# EAGLE design schematic (EAGLE 8.3.0)
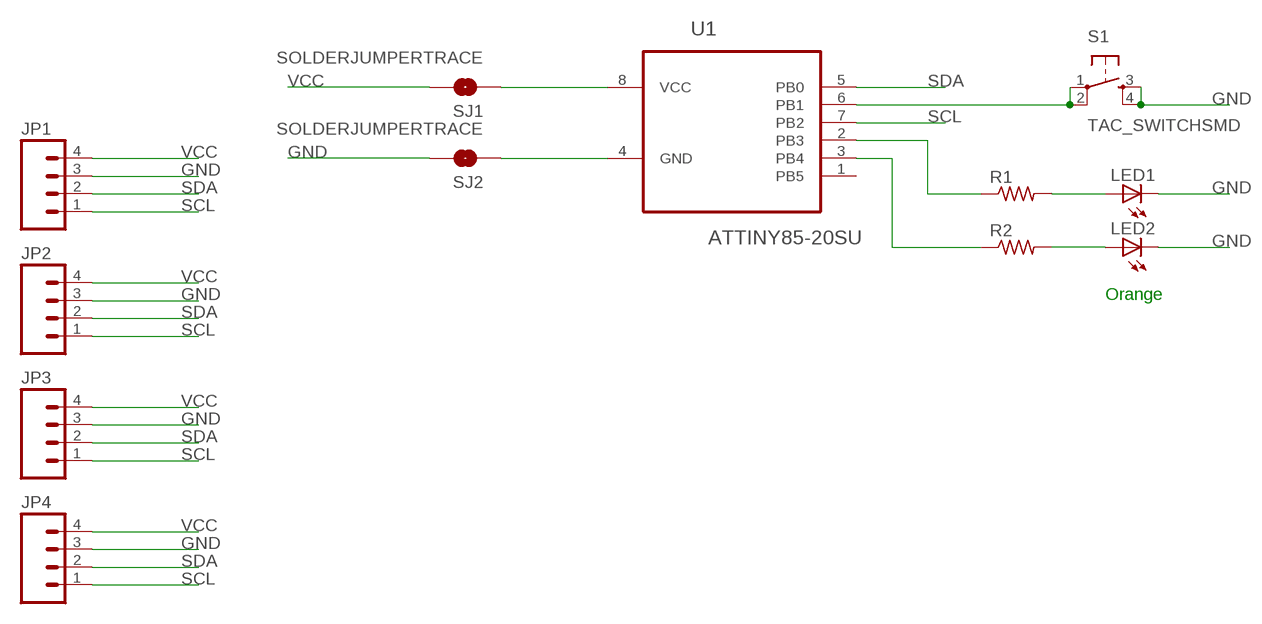
[diagram p0: schematic, sheet 1]

## Parts
JP1  M041X04_NO_SILK  [1X04_NO_SILK]
JP2  M041X04_NO_SILK  [1X04_NO_SILK]
JP3  M041X04_NO_SILK  [1X04_NO_SILK]
JP4  M041X04_NO_SILK  [1X04_NO_SILK]
LED1  LEDCHIP-LED0805  [CHIP-LED0805]
LED2  LEDCHIP-LED0805  [CHIP-LED0805]
R1  R-US_R0805  [R0805]
R2  R-US_R0805  [R0805]
S1  TAC_SWITCHSMD  [TACTILE-SWITCH-SMD]
SJ1  SOLDERJUMPERTRACE  [SJ_2S-TRACE]
SJ2  SOLDERJUMPERTRACE  [SJ_2S-TRACE]
U1  ATTINY85-20SU  [SOIC127P798X216-8N]

## Nets
GND: JP1.3 JP2.3 JP3.3 JP4.3 LED1.C LED2.C S1.3 S1.4 SJ2.2
N$1: R2.1 U1.3(PB4)
N$2: R1.1 U1.2(PB3)
N$3: LED1.A R1.2
N$4: LED2.A R2.2
N$5: S1.1 S1.2 U1.6(PB1)
N$8: SJ1.1 U1.8(VCC)
N$9: SJ2.1 U1.4(GND)
SCL: JP1.1 JP2.1 JP3.1 JP4.1 U1.7(PB2)
SDA: JP1.2 JP2.2 JP3.2 JP4.2 U1.5(PB0)
VCC: JP1.4 JP2.4 JP3.4 JP4.4 SJ1.2
Unconnected: U1.1(PB5)

## Notes on the sheet
- Orange

## Library data of the parts
JP1-JP4 = SparkFun-Connectors:M04: Header 4 Standard 4-pin 0.1" header. Use with straight break away headers (SKU : PRT-00116), right angle break away headers (PRT-00553), swiss pins (PRT-00743), machine pins (PRT-00117), and female headers (PRT-00115). Molex polarized connector foot print use with SKU : PRT-08231 with associated crimp pins and housings. 1MM SMD Version SKU: PRT-10208
LED1 LED2 = adafruit:LED: LED OSRAM: - CHIPLED LG R971, LG N971, LY N971, LG Q971, LY Q971, LO R971, LY R971 LH N974, LH R974 LS Q976, LO Q976, LY Q976 LO Q996 - Hyper CHIPLED LW Q18S LB Q993, LB Q99A, LB R99A - SideLED LS A670, LO A670, LY A670, LG A670, LP A670 LB A673, LV A673, LT A673, LW A673 LH A674 LY A675 LS A676, LA A676, LO A676, LY A676, LW A676 LS A679, LY A679, LG A679 - Hyper Micro SIDELED® LS Y876, LA Y876, LO Y876, LY Y876 LT Y87S - SmartLED LW L88C, LW L88S LB L89C, LB L89S, LG L890 LS L89K, LO L89K, LY L89K LS L896, LA L896, LO L896, LY L896 - TOPLED LS T670, LO T670, LY T670, LG T670, LP T670 LSG T670, LSP T670, LSY T670, LOP T670, LYG T670 LG T671, LOG T671, LSG T671 LB T673, LV T673, LT T673, LW T673 LH T674 LS T676, LA T676, LO T676, LY T676, LB T676, LH T676, LSB T676, LW T676 LB T67C, LV T67C, LT T67C, LS T67K, LO T67K, LY T67K, LW E67C LS E67B, LA E67B, LO E67B, LY E67B, LB E67C, LV E67C, LT E67C LW T67C LS T679, LY T679, LG T679 LS T770, LO T770, LY T770, LG T770, LP T770 LB T773, LV T773, LT T773, LW T773 LH T774 LS E675, LA E675, LY E675, LS T675 LS T776, LA T776, LO T776, LY T776, LB T776 LHGB T686 LT T68C, LB T68C - Hyper Mini TOPLED® LB M676 - Mini TOPLED Santana® LG M470 LS M47K, LO M47K, LY M47K Source: http://www.osram.convergy.de/
R1 R2 = adafruit:R-US_: RESISTOR, American symbol
S1 = SparkFun-Retired:TAC_SWITCH: Momentary Switch Button commonly used for reset or general input. Spark Fun Electronics SKU : COM-00097 SMT- SWCH-08247; PROD_ID: SWCH-08247
SJ1 SJ2 = SparkFun-Retired:SOLDERJUMPER: Solder Jumper Standard SMD solder jumper. Used to automate production. Two varients : Normally Open and Normally Closed are the same, but have different paste layers. NC will have a large amount of paste and should jumper during reflow.
U1 = Atmel_By_element14_Batch_1-00:ATTINY85-20SU: 8-bit Microcontroller with In-System Programmable Flash; MPN: ATTINY85-20SU; OC_FARNELL: 1455164; OC_NEWARK: 58M3797; PACKAGE: SOIC-8; SUPPLIER: Atmel

## Board
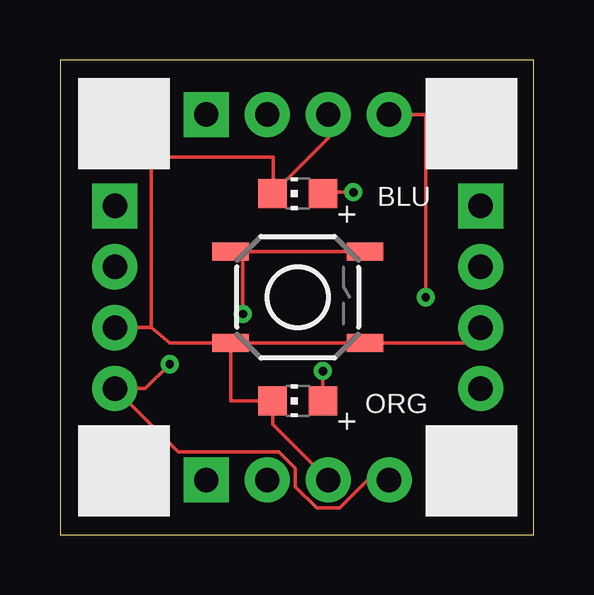
[diagram p1: board, top side]
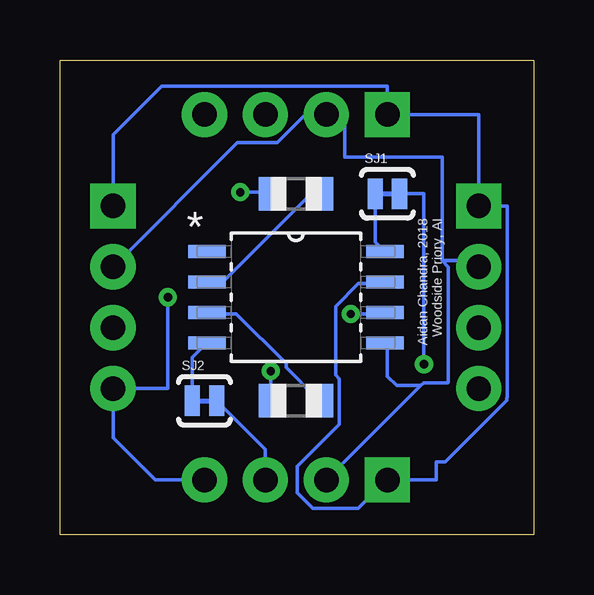
[diagram p2: board, bottom side, seen from below]

Size 19.74 x 19.8 mm. Coordinates in mm from the lower left corner, seen from the top.
Outline: 0,0 19.74,0 19.74,19.8 0,19.8 0,0
Copper layers (1*16): Top 0.035mm / dielectric 1.5mm / Bottom 0.035mm
Design rules "default": minimum track width 6mil, minimum drill 0.35mm, track to track 6mil, track to pad 6mil, pad to pad 6mil, via to via 6mil, smd to smd 6mil, copper to edge 40mil, drill to drill 6mil, minimum pad ring 10mil, minimum via ring 8mil, stop-mask expansion 4mil, vias tented up to drill 0mil, thermal gap 10mil

### Footprints (pad centres in the part's own frame; a part is rotated, then mirrored left to right if it is on the bottom)
1X04_NO_SILK = drill 1.016 pad 1.88 square: 1 0,0 | drill 1.016 pad 1.88: 2 2.54,0; 3 5.08,0; 4 7.62,0
CHIP-LED0805 = smd 1.2 x 1.2: A 0,-1.05; C 0,1.05
R0805 = smd 1.1 x 1.4: 1 -1,0; 2 1,0
TACTILE-SWITCH-SMD = smd 1.524 x 0.762: 1 -2.794,1.905; 2 2.794,1.905; 3 -2.794,-1.905; 4 2.794,-1.905
SJ_2S-TRACE = smd 0.635 x 1.27: 1 -0.508,0; 2 0.508,0
SOIC127P798X216-8N = smd 1.549 x 0.533: 1 -3.708,1.905; 2 -3.708,0.635; 3 -3.708,-0.635; 4 -3.708,-1.905; 5 3.708,-1.905; 6 3.708,-0.635; 7 3.708,0.635; 8 3.708,1.905

### Placement (x,y rotation side)
JP1  2.29,13.72 270 top
JP2  6.1,2.29 0 top
JP3  17.53,13.72 270 top
JP4  6.1,17.53 0 top
LED1  9.91,14.22 90 top
LED2  9.91,5.59 90 top
R1  9.91,14.22 180 bottom
R2  9.91,5.59 180 bottom
S1  9.91,9.91 0 top
SJ1  6.1,14.22 0 bottom
SJ2  13.72,5.59 0 bottom
U1  9.91,9.91 0 bottom

### Tracks (layer width: path | path; a pad name or v marks a point on that pad's centre or on a via)
GND
  Top 0.152: JP1.3 3.81,8.64 | JP4.3 11.18,16.54 LED1.C 8.89,14.26 8.89,15.75 3.81,15.75 3.81,8.64 | S1.3 S1.4 17.53,8 JP3.3 | S1.3 4.57,8 3.81,8.64 | JP2.3 8.86,4.61 LED2.C 7.11,5.59 S1.3
  Bottom 0.152: JP2.3 11.18,3.56 SJ2.2
N$1
  Bottom 0.152: R2.1 9.05,5.71 10.32,6.99 10.32,7.14 12.38,9.21 13.49,9.21 U1.3
N$2
  Bottom 0.152: R1.1 9.05,14.13 9.37,14.13 12.86,10.64 13.49,10.64 U1.2
N$3  (via drill 0.35)
  Top 0.152: v12.22,14.29 11.11,14.29 LED1.A
  Bottom 0.152: v12.22,14.29 10.95,14.29 R1.2
N$4  (via drill 0.35)
  Top 0.152: v10.95,6.83 10.95,5.71 LED2.A
  Bottom 0.152: v10.95,6.83 10.95,5.71 R2.2
N$5  (via drill 0.35)
  Top 0.152: S1.2 S1.1 7.62,11.75 v7.62,9.21
  Bottom 0.152: v7.62,9.21 6.35,9.21 U1.6
N$8
  Bottom 0.152: SJ1.1 6.6,12.22 U1.8
N$9
  Bottom 0.152: SJ2.1 14.22,7.39 U1.4
SCL
  Bottom 0.152: U1.7 6.35,10.48 7.3,10.48 8.26,9.53 8.26,6.67 8.1,6.51 8.1,4.6 9.84,2.86 9.84,1.75 9.21,1.11 7.3,1.11 6.19,2.22 JP2.1 4.83,2.29 4.66,2.29 4.06,2.29 4.06,3.05 3.68,3.05 1.12,5.61 1.12,5.7 1.09,5.72 1.09,13.72 JP1.1 2.29,17.53 JP4.1 6.1,18.71 15.49,18.71 17.53,16.68 JP3.1
SDA
  Bottom 0.152: JP2.2 4.7,6.22 | 4.7,6.22 4.59,6.33 3.57,6.33 3.56,6.35 3.56,11.18 3.81,11.43 | 3.81,11.43 2.29,11.43 JP1.2 | 3.81,11.43 3.81,15.75 7.87,15.75 7.87,17.53 JP4.2 9.52,17.53 10.69,16.36 12.34,16.36 JP3.2 | U1.5 6.19,7.94 6.1,7.84 6.1,6.6 5.71,6.22 4.7,6.22
VCC  (via drill 0.35)
  Top 0.152: JP2.4 12.83,2.29 11.66,1.12 10.69,1.12 9.8,2 9.8,2.77 9.12,3.45 4.93,3.45 JP1.4 3.56,6.1 v4.57,7.11 | v15.24,9.91 15.24,17.53 JP4.4
  Bottom 0.152: 15.24,10 v15.24,9.91 15.24,6.1 JP3.4 17.53,4.05 15.77,2.29 JP2.4 | v4.57,7.11 4.57,14.22 5.35,14.22 5.38,14.22 SJ1.2

### Text on the board
tNames: BLU | ORG
bNames: Aidan Chandra, 2018 / Woodside Priory, AI